# Altium schematic sheet BuckConverter.SchDoc
size A4; SheetNumber: 2; SheetTotal: 2
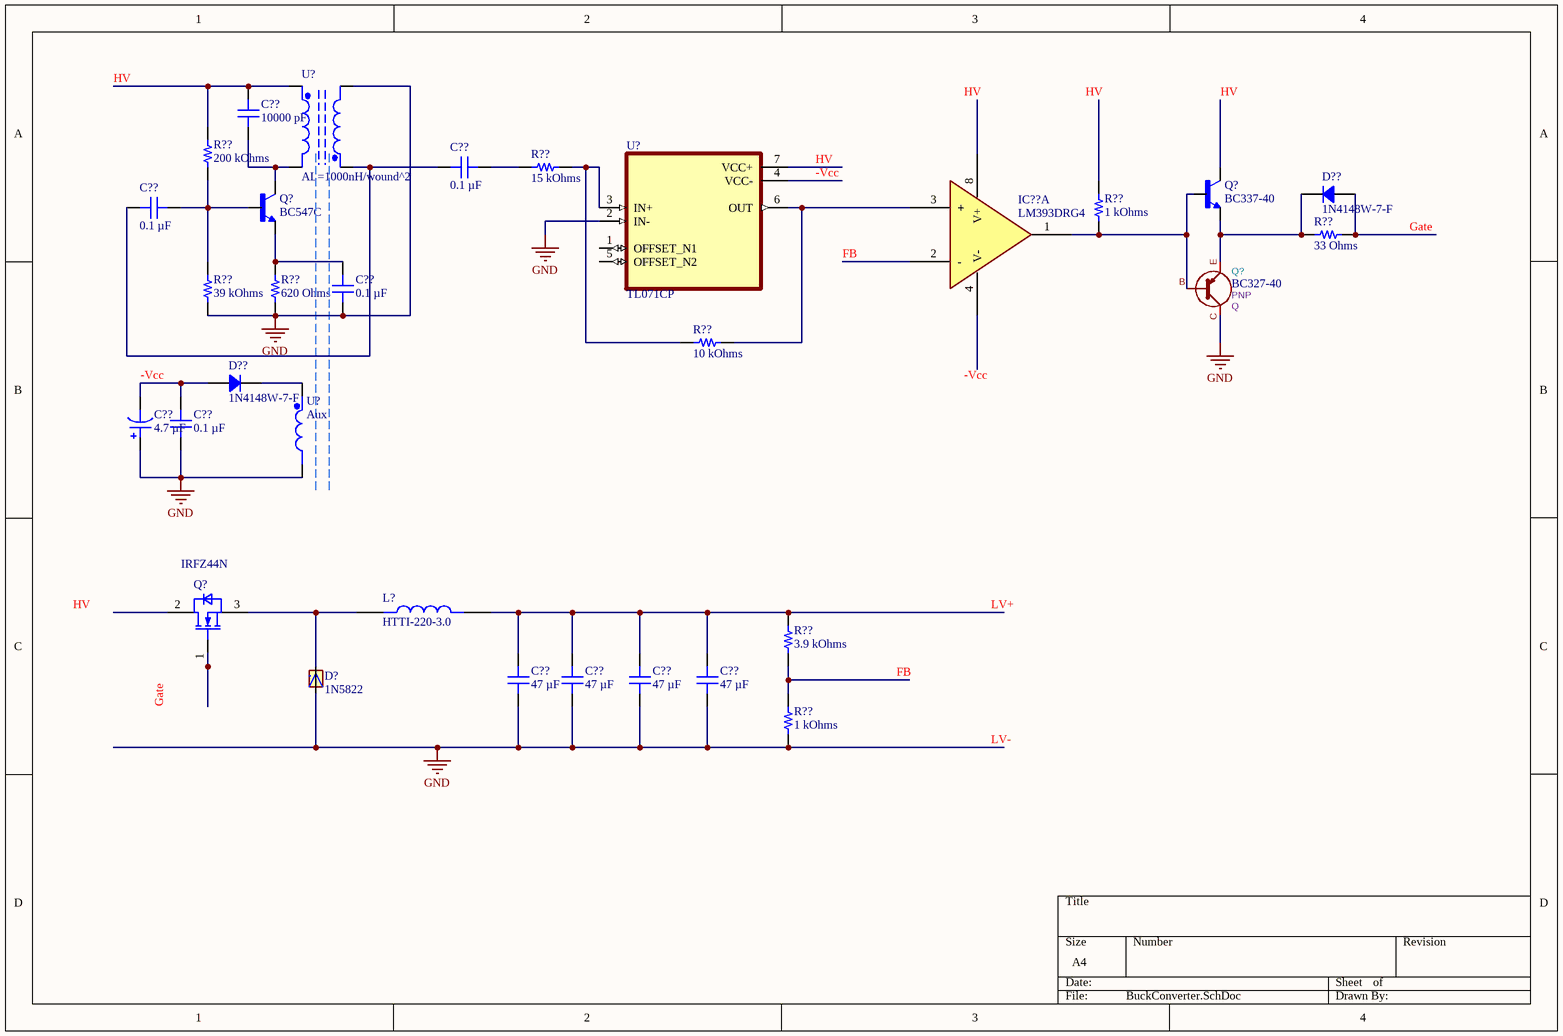
[diagram p0: BuckConverter.SchDoc]

## Parts
(Parts that share a designator on the sheet are numbered #1, #2 ... from top to bottom, then left to right.)
C??#1  10000 pF  [CAP 1812_4532 1.1MM]
C??#2  0.1 µF  [CAP 0805_2012]
C??#3  0.1 µF  [CAP 0805_2012]
C??#4  0.1 µF  [CAP 0805_2012]
C??#5  4.7 µF  [CAP ALSMD 4.3MM H5.4MM]
C??#6  0.1 µF  [CAP 0805_2012]
C??#7  47 µF  [CAP 1210_3225 - 1MM]
C??#8  47 µF  [CAP 1210_3225 - 1MM]
C??#9  47 µF  [CAP 1210_3225 - 1MM]
C??#10  47 µF  [CAP 1210_3225 - 1MM]
D?  1N5822  [DIOAD2120W130L950D530P]
D??#1  1N4148W-7-F  [SOD-123]
D??#2  1N4148W-7-F  [SOD-123]
IC??  LM393DRG4  [TI SOIC-8 D]  (part A of 2)
L?  HTTI-220-3.0  [IND_HTTI-220-3.0]
Q?#1  BC337-40  [TO92127P460H470-3]
Q?#2  BC547C  [TRANS_BC547C]
Q?#3  BC327-40  value PNP  Reference: Q  [TO-92_CBE]
Q?#4  IRFZ44N
R??#1  200 kOhms  [RES 0805_2012]
R??#2  15 kOhms  [RES 0603_1608]
R??#3  1 kOhms  [RES 1206_3216]
R??#4  33 Ohms  [RES 1206_3216]
R??#5  39 kOhms  [YAGEO RES 0805_2012]
R??#6  620 Ohms  [RES 0805_2012]
R??#7  10 kOhms  [RES 0603_1608]
R??#8  3.9 kOhms  [RES 0603_1608]
R??#9  1 kOhms  [RES 0603_1608]
U?#1  AL=1000nH/wound^2  [EE16 N27 Ungapped]
U?#2  TL071CP  [DIP794W45P254L959H508Q8]
U?#3  Aux  [1206 Bead]

## Nets
GND: C??#4.1 C??#5.1 C??#6.1 C??#7.1 C??#8.1 C??#9.1 C??#10.1 D?.A Q?#3.C R??#5.1 R??#6.1 R??#9.1 U?#1.2 U?#2.2(IN-) U?#3.2
NetC??#1_1: C??#1.1 Q?#2.1(C) U?#1.4
NetC??#1_2: C??#1.2 R??#1.2 U?#1.1
NetC??#2_1: C??#2.1 C??#3.2 U?#1.3
NetC??#2_2: C??#2.2 R??#2.1
NetC??#3_1: C??#3.1 Q?#2.2(B) R??#1.1 R??#5.2
NetC??#4_2: C??#4.2 Q?#2.3(E) R??#6.2
NetC??#5_2: C??#5.2 C??#6.2 D??#2.1
NetC??#7_2: C??#7.2 C??#8.2 C??#9.2 C??#10.2 L?.2 R??#8.2
NetD??#1_1: D??#1.1 R??#4.2
NetD??#1_2: D??#1.2 Q?#1.3(E) Q?#3.E R??#4.1
NetD??#2_2: D??#2.2 U?#3.1
NetD?_C: D?.C L?.1 Q?#4.3(SOURCE)
NetIC??_1: IC??.1(OUTA) Q?#1.2(B) Q?#3.B R??#3.1
NetIC??_3: IC??.3(+) R??#7.2 U?#2.6(OUT)
NetR??#2_2: R??#2.2 R??#7.1 U?#2.3(IN+)
NetR??#8_1: R??#8.1 R??#9.2

Not connected (* = marked no-connect by the designer): IC?? 2(-) 4(V-) 8(V+); Q?#1 1(C); Q?#4 1(GATE) 2(DRAIN); R??#3 2; U?#2 1(OFFSET_N1) 4(VCC-) 5(OFFSET_N2) 7(VCC+)

## Notes on the sheet
- HV
- -Vcc
- Gate
- FB
- (near C??#5) -Vcc
- LV+
- (near Q?#4) Gate
- LV-

## Library data of the parts
C??#1 = 1812J1K00103JKT: 1812 1000VDC 10NF 5% C0G/NP0(1B); manufacturer: Knowles Syfer; Temperature Coefficient: C0G, NP0 (1B); Voltage - Rated: 1000V (1kV); Part Number: 1812J1K00103JKT; Value: 10000 pF; Applications: Automotive; Capacitance: 10000 pF; componentlink2description: DigiKey Link; componentlink2url: https://www.digikey.com/en/products/detail/knowles-syfer/1812J1K00103JKT/18879719; Device Package: 1812 (4532 Metric); Features: High Voltage; lastupdated: 6.04.2026 19:46:49; Lifecycle Status: Active; Minimum Order: 1; Mounting Type: Surface Mount, MLCC; Operating Temperature: -55°C ~ 125°C; Package / Case: 1812 (4532 Metric); packaging: TapeAndReel; Part Status: Active; price: 0.87; Ratings: AEC-Q200; series: -; Size / Dimension: 0.177" L x 0.126" W (4.50mm x 3.20mm); Supplier 1: DigiKey; Supplier Part Number 1: 1608-1812J1K00103JKTCT-ND; Thickness (Max): 0.126" (3.20mm); Tolerance: ±5%
C??#2-C??#4 C??#6 = GMC21X5R104K10NT: CAP0805 X5R .1UF 10% 35V; manufacturer: Cal-Chip Electronics, Inc.; Voltage - Rated: 10V; Part Number: GMC21X5R104K10NT; Applications: General Purpose; componentlink1description: Datasheet; componentlink1url: https://calchip.com/wp-content/uploads/2024/02/gmc_series-1.pdf; componentlink2description: DigiKey Link; componentlink2url: https://www.digikey.com/en/products/detail/cal-chip-electronics-inc/GMC21X5R104K10NT/25622748; Device Package: 0805 (2012 Metric); lastupdated: 6.04.2026 19:28:50; Lifecycle Status: Active; Minimum Order: 1; Mounting Type: Surface Mount, MLCC; Operating Temperature: -55°C ~ 85°C; Package / Case: 0805 (2012 Metric); packaging: TapeAndReel; partid: 70307; price: 0.01; series: GMC; Size / Dimension: 0.079" L x 0.049" W (2.00mm x 1.25mm); Supplier 1: DigiKey; Supplier Part Number 1: 4713-GMC21X5R104K10NTCT-ND; Temperature Coefficient: X5R; Thickness (Max): 0.037" (0.95mm); Tolerance: ±10%; value: 0.1 µF; Capacitance: 0.1 µF
C??#5 = EEE-1CA4R7NR: CAP ALUM 4.7UF 20% 16V SMD; manufacturer: Panasonic Electronic Components; Lifetime @ Temp.: 2000 Hrs @ 85°C; Polarization: Polar; Ripple Current @ High Frequency: 34 mA @ 10 kHz; Ripple Current @ Low Frequency: 20 mA @ 120 Hz; Surface Mount Land Size: 0.169" L x 0.169" W (4.30mm x 4.30mm); Part Number: EEE-1CA4R7NR; Applications: Automotive; Capacitance: 4.7 µF; componentlink1description: Datasheet; componentlink1url: //media.digikey.com/pdf/Data%20Sheets/Panasonic%20Electronic%20Components/S_Series,Type_V_Rev2018.pdf; componentlink2description: DigiKey Link; componentlink2url: https://www.digikey.com/en/products/detail/panasonic-electronic-components/EEE-1CA4R7NR/946205; Device Package: Radial, Can - SMD; Height - Seated (Max): 0.217" (5.50mm); lastupdated: 5.04.2026 20:29:49; Lifecycle Status: Active; Minimum Order: 1; Mounting Type: Surface Mount; Operating Temperature: -40°C ~ 85°C; Package / Case: Radial, Can - SMD; packaging: TapeAndReel; partid: 7087; Part Status: Active; price: 0.07; Ratings: AEC-Q200; series: S; Size / Dimension: 0.157" Dia (4.00mm); Supplier 1: DigiKey; Supplier Part Number 1: PCE4290CT-ND; Tolerance: ±20%; value: 4.7 µF; Voltage - Rated: 16 V
C??#7-C??#10 = C1210C476M4PAC7800: CAP CER 47UF 16V X5R 1210; manufacturer: KEMET; Tolerance: ±20%; Part Number: C1210C476M4PAC7800; Applications: Bypass, Decoupling; Capacitance: 47 µF; componentlink1description: Datasheet; componentlink1url: https://connect.kemet.com:7667/gateway/IntelliData-ComponentDocumentation/1.0/download/datasheet/C1210C476M4PACTU; componentlink2description: DigiKey Link; componentlink2url: https://www.digikey.com/en/products/detail/kemet/C1210C476M4PAC7800/1950674; Device Package: 1210 (3225 Metric); lastupdated: 6.04.2026 19:45:26; Lifecycle Status: Active; Minimum Order: 1; Mounting Type: Surface Mount, MLCC; Operating Temperature: -55°C ~ 85°C; Package / Case: 1210 (3225 Metric); packaging: TapeAndReel; partid: 45193; Part Status: Active; price: 0.32; series: SMD Comm X5R; Size / Dimension: 0.126" L x 0.098" W (3.20mm x 2.50mm); Supplier 1: DigiKey; Supplier Part Number 1: 399-C1210C476M4PAC7800CT-ND; Temperature Coefficient: X5R; Thickness (Max): 0.110" (2.80mm); Voltage - Rated: 16V; Value: 47 µF
D? = 1N5822: Schottky, DO-201, 40V, 3A, 150Â°C; MF: Diotec Semiconductor; SnapEDA_Link: https://www.snapeda.com/parts/1N5822/Diotec/view-part/?ref=snap; Package: DO-201 Diotec; Value: *; MP: 1N5822; Check_prices: https://www.snapeda.com/parts/1N5822/Diotec/view-part/?ref=eda
D??#1 D??#2 = 1N4148W-7-F: DIODE STANDARD 100V 150MA SOD123; Manufacturer: Diodes Incorporated; Capacitance @ Vr, F: 2pF @ 0V, 1MHz; Current - Reverse Leakage @ Vr: 1 µA @ 75 V; Reverse Recovery Time (trr): 4 ns; Speed: Fast Recovery =< 500ns, > 200mA (Io); Voltage - Forward (Vf) (Max) @ If: 1.25 V @ 150 mA; Part Number: 1N4148W-7-F; ComponentLink1Description: Datasheet; ComponentLink1URL: https://www.diodes.com/assets/Datasheets/ds30086.pdf; ComponentLink2Description: DigiKey Link; ComponentLink2URL: https://www.digikey.com/en/products/detail/diodes-incorporated/1N4148W-7-F/814371; Current - Average Rectified (Io): 150mA; Diode Type: Standard; LastUpdated: 5.04.2026 20:31:46; Lifecycle Status: Active; Minimum Order: 1; Mounting Type: Surface Mount; Operating Temperature - Junction: -55°C ~ 150°C; Package / Case: SOD-123; Packaging: TapeAndReel; PartId: 1002; Part Status: Active; Price: 0.02; Series: -; Supplier 1: DigiKey; Supplier Part Number 1: 1N4148W-FDICT-ND; Supplier Device Package: SOD-123; Voltage - DC Reverse (Vr) (Max): 100 V
IC?? = LM393DRG4: IC DUAL DIFF COMPARATOR 8-SOIC; Manufacturer: Texas Instruments; Current - Input Bias (Max): 0.25µA @ 5V; Current - Output (Typ): 20mA; Current - Quiescent (Max): 2.5mA; Number of Elements: 2; Output Type: CMOS, MOS, Open-Drain, TTL; Voltage - Input Offset (Max): 5mV @ 30V; Voltage - Supply, Single/Dual (±): 2V ~ 36V, ±1V ~ 18V; Part Number: LM393DRG4; ComponentLink1Description: Datasheet; ComponentLink1URL: http://www.ti.com/general/docs/suppproductinfo.tsp?distId=10&gotoUrl=http%3A%2F%2Fwww.ti.com%2Flit%2Fgpn%2Flm193; ComponentLink2Description: DigiKey Link; ComponentLink2URL: http://digikey.com/product-detail/en/texas-instruments/LM393DRG4/296-31672-1-ND/3505876; Device Package: 8-SOIC (0.154", 3.90mm Width); LastUpdated: 30.03.2020 15:17:12; Lifecycle Status: Active; Minimum Order: 1; Mounting Type: Surface Mount; Operating Temperature: 0°C ~ 70°C; Package / Case: 8-SOIC (0.154", 3.90mm Width); Packaging: TapeAndReel; Part Status: Active; Price: 0.10; Series: -; Supplier 1: DigiKey; Supplier Part Number 1: 296-31672-1-ND; Supplier Device Package: 8-SOIC; Type: Differential
L? = HTTI-220-3.0: High Current High Temperature Toroidal Inductor | 220uH | 3A | 0.13Ohm; MF: Signal Transformer; SnapEDA_Link: https://www.snapeda.com/parts/HTTI-220-3.0/Signal+Transformer/view-part/?ref=snap; Package: None; Value: *; MP: HTTI-220-3.0; Check_prices: https://www.snapeda.com/parts/HTTI-220-3.0/Signal+Transformer/view-part/?ref=eda
Q?#1 = BC337-40: BJT, TO-92, 45V, 800mA, NPN, 0.625W, 150Â°C; MF: Diotec Semiconductor; SnapEDA_Link: https://www.snapeda.com/parts/BC337-40/Diotec/view-part/?ref=snap; Package: TO-92 Diotec; Value: *; MP: BC337-40; Check_prices: https://www.snapeda.com/parts/BC337-40/Diotec/view-part/?ref=eda
Q?#2 = BC547C: BJT, TO-92, 45V, 100mA, NPN, 0.5W, 150Â°C; MF: Diotec Semiconductor; SnapEDA_Link: https://www.snapeda.com/parts/BC547C/Diotec/view-part/?ref=snap; Package: TO-92 Diotec; Value: *; MP: BC547C; Check_prices: https://www.snapeda.com/parts/BC547C/Diotec/view-part/?ref=eda
Q?#3 = PNP: ki_keywords: PNP Bipolar Transistor; ki_description: Symbol for PNP BJT
Q?#4 = IRFZ44N: OptiMOS 3 Power-Transistor, VDS 100V; Manufacturer: Infineon Technologies; Manufacturer Order Number: IRFZ44N; PackageReference: PG-TO220-3-904
R??#1 = RNCF0805DTE200K: RES SMD 200K OHM 0.5% 1/4W 0805; Manufacturer: Stackpole Electronics Inc; Power (Watts): 0.25W, 1/4W; Temperature Coefficient: ±25ppm/°C; Part Number: RNCF0805DTE200K; Value: 200 kOhms; ComponentLink1Description: Datasheet; ComponentLink1URL: https://www.seielect.com/catalog/sei-rncf.pdf; ComponentLink2Description: DigiKey Link; ComponentLink2URL: https://www.digikey.com/en/products/detail/stackpole-electronics-inc/RNCF0805DTE200K/6242022; Composition: Thin Film; Device Package: 0805 (2012 Metric); Features: Automotive AEC-Q200; Height - Seated (Max): 0.026" (0.65mm); LastUpdated: 5.04.2026 20:11:25; Lifecycle Status: Active; Minimum Order: 1; Number of Terminations: 2; Operating Temperature: -55°C ~ 155°C; Package / Case: 0805 (2012 Metric); Packaging: TapeAndReel; PartId: 27998; Part Status: Active; Price: 0.01; Ratings: AEC-Q200; Resistance: 200 kOhms; Series: RNCF; Size / Dimension: 0.079" L x 0.049" W (2.00mm x 1.25mm); Supplier 1: DigiKey; Supplier Part Number 1: 738-RNCF0805DTE200KCT-ND; Supplier Device Package: 0805; Tolerance: ±0.5%
R??#2 = RMCF0603JG15K0: RES 15K OHM 5% 1/10W 0603; Manufacturer: Stackpole Electronics Inc; Power (Watts): 0.1W, 1/10W; Temperature Coefficient: ±200ppm/°C; Part Number: RMCF0603JG15K0; Value: 15 kOhms; ComponentLink1Description: Datasheet; ComponentLink1URL: https://www.seielect.com/catalog/sei-rmcf_rmcp.pdf; ComponentLink2Description: DigiKey Link; ComponentLink2URL: https://www.digikey.com/en/products/detail/stackpole-electronics-inc/RMCF0603JG15K0/1712157; Composition: Thick Film; Device Package: 0603 (1608 Metric); Features: Automotive AEC-Q200; Height - Seated (Max): 0.022" (0.55mm); LastUpdated: 9.02.2024 20:43:35; Lifecycle Status: Active; Minimum Order: 1; Number of Terminations: 2; Operating Temperature: -55°C ~ 155°C; Package / Case: 0603 (1608 Metric); Packaging: CutTape; PartId: 5200; Part Status: Active; Price: 0.01; Ratings: AEC-Q200; Resistance: 15 kOhms; Series: RMCF; Size / Dimension: 0.061" L x 0.031" W (1.55mm x 0.80mm); Supplier 1: DigiKey; Supplier Part Number 1: RMCF0603JG15K0CT-ND; Supplier Device Package: 0603; Tolerance: ±5%
R??#3 = 3430B2F1K0TDF: 3430 B2 1% 1K0 100PPM 1K RL; Manufacturer: TE Connectivity Passive Product; Power (Watts): 1.5W; Temperature Coefficient: ±100ppm/°C; Part Number: 3430B2F1K0TDF; ComponentLink2Description: DigiKey Link; ComponentLink2URL: https://www.digikey.com/en/products/detail/te-connectivity-passive-product/3430B2F1K0TDF/17764078; Composition: Thick Film; Device Package: 1206 (3216 Metric); Features: Automotive AEC-Q200; Height - Seated (Max): 0.026" (0.65mm); LastUpdated: 6.04.2026 19:58:24; Lifecycle Status: Active; Minimum Order: 1; Number of Terminations: 2; Operating Temperature: -55°C ~ 155°C; Package / Case: 1206 (3216 Metric); Packaging: TapeAndReel; PartId: 77709; Part Status: Active; Price: 0.07; Ratings: AEC-Q200; Resistance: 1 kOhms; Series: 3430; Size / Dimension: 0.061" L x 0.118" W (1.55mm x 3.00mm); Supplier 1: DigiKey; Supplier Part Number 1: 1712-3430B2F1K0TDFCT-ND; Supplier Device Package: 0612; Tolerance: ±1%; Value: 1 kOhms
R??#4 = AC1206JR-0733RL: RES SMD 33 OHM 5% 1/4W 1206; Manufacturer: Yageo; Power (Watts): 0.25W, 1/4W; Temperature Coefficient: ±100ppm/°C; Part Number: AC1206JR-0733RL; ComponentLink1Description: Datasheet; ComponentLink1URL: https://www.yageo.com/upload/media/product/productsearch/datasheet/rchip/PYu-AC_51_RoHS_L_7.pdf; ComponentLink2Description: DigiKey Link; ComponentLink2URL: https://www.digikey.com/en/products/detail/yageo/AC1206JR-0733RL/5897837; Composition: Thick Film; Device Package: 1206 (3216 Metric); Features: Automotive AEC-Q200, Moisture Resistant; Height - Seated (Max): 0.026" (0.65mm); LastUpdated: 6.04.2026 20:00:51; Lifecycle Status: Active; Minimum Order: 1; Number of Terminations: 2; Operating Temperature: -55°C ~ 155°C; Package / Case: 1206 (3216 Metric); Packaging: TapeAndReel; PartId: 27117; Part Status: Active; Price: 0.01; Ratings: AEC-Q200; Resistance: 33 Ohms; Series: AC; Size / Dimension: 0.122" L x 0.063" W (3.10mm x 1.60mm); Supplier 1: DigiKey; Supplier Part Number 1: YAG3955CT-ND; Supplier Device Package: 1206; Tolerance: ±5%; Value: 33 Ohms
R??#5 = AC0805FR-0739KL: RES SMD 39K OHM 1% 1/8W 0805; Manufacturer: Yageo; Power (Watts): 0.125W, 1/8W; Temperature Coefficient: ±100ppm/°C; Part Number: AC0805FR-0739KL; Value: 39 kOhms; ComponentLink1Description: Datasheet; ComponentLink1URL: https://www.yageo.com/upload/media/product/productsearch/datasheet/rchip/PYu-AC_51_RoHS_L_7.pdf; ComponentLink2Description: DigiKey Link; ComponentLink2URL: https://www.digikey.com/en/products/detail/yageo/AC0805FR-0739KL/5896800; Composition: Thick Film; Device Package: 0805 (2012 Metric); Features: Automotive AEC-Q200, Moisture Resistant; Height - Seated (Max): 0.024" (0.60mm); LastUpdated: 5.04.2026 21:18:18; Lifecycle Status: Active; Minimum Order: 1; Number of Terminations: 2; Operating Temperature: -55°C ~ 155°C; Package / Case: 0805 (2012 Metric); Packaging: CutTape; PartId: 27853; Part Status: Active; Price: 0.01; Ratings: AEC-Q200; Resistance: 39 kOhms; Series: AC; Size / Dimension: 0.079" L x 0.049" W (2.00mm x 1.25mm); Supplier 1: DigiKey; Supplier Part Number 1: YAG3727CT-ND; Supplier Device Package: 0805; Tolerance: ±1%
R??#6 = CRCW0805620RFKEA: RES SMD 620 OHM 1% 1/8W 0805; Manufacturer: Vishay Dale; Power (Watts): 0.125W, 1/8W; Temperature Coefficient: ±100ppm/°C; Part Number: CRCW0805620RFKEA; Value: 620 Ohms; ComponentLink1Description: Datasheet; ComponentLink1URL: http://www.vishay.com/docs/20035/dcrcwe3.pdf; ComponentLink2Description: DigiKey Link; ComponentLink2URL: https://www.digikey.com/en/products/detail/vishay-dale/CRCW0805620RFKEA/1175614; Composition: Thick Film; Device Package: 0805 (2012 Metric); Features: Automotive AEC-Q200; Height - Seated (Max): 0.020" (0.50mm); LastUpdated: 5.04.2026 20:11:04; Lifecycle Status: Active; Minimum Order: 1; Number of Terminations: 2; Operating Temperature: -55°C ~ 155°C; Package / Case: 0805 (2012 Metric); Packaging: TapeAndReel; PartId: 32921; Part Status: Active; Price: 0.01; Ratings: AEC-Q200; Resistance: 620 Ohms; Series: D/CRCW e3; Size / Dimension: 0.079" L x 0.049" W (2.00mm x 1.25mm); Supplier 1: DigiKey; Supplier Part Number 1: 541-620CCT-ND; Supplier Device Package: 0805; Tolerance: ±1%
R??#7 = RNCS0603BKE10K0: RES 10K OHM 0.1% 1/16W 0603; Manufacturer: Stackpole Electronics Inc; Power (Watts): 0.063W, 1/16W; Temperature Coefficient: ±25ppm/°C; Part Number: RNCS0603BKE10K0; Value: 10 kOhms; ComponentLink1Description: Datasheet; ComponentLink1URL: https://www.seielect.com/catalog/sei-rncs_rnch.pdf; ComponentLink2Description: DigiKey Link; ComponentLink2URL: https://www.digikey.com/en/products/detail/stackpole-electronics-inc/RNCS0603BKE10K0/1708836; Composition: Thin Film; Device Package: 0603 (1608 Metric); Features: Anti-Corrosive, Automotive AEC-Q200, Moisture Resistant; Height - Seated (Max): 0.022" (0.55mm); LastUpdated: 9.02.2024 20:43:37; Lifecycle Status: Active; Minimum Order: 1; Number of Terminations: 2; Operating Temperature: -55°C ~ 155°C; Package / Case: 0603 (1608 Metric); Packaging: TapeAndReel; PartId: 4838; Part Status: Active; Price: 0.06; Ratings: AEC-Q200; Resistance: 10 kOhms; Series: RNCS; Size / Dimension: 0.061" L x 0.031" W (1.55mm x 0.80mm); Supplier 1: DigiKey; Supplier Part Number 1: RNCS0603BKE10K0CT-ND; Supplier Device Package: 0603; Tolerance: ±0.1%
R??#8 = CMP0603-FX-3901ELF: RESHIGHPOWER 0603 3K9 1% 1/4W TC; Manufacturer: Bourns Inc.; Power (Watts): 0.25W, 1/4W; Temperature Coefficient: ±100ppm/°C; Part Number: CMP0603-FX-3901ELF; Value: 3.9 kOhms; ComponentLink1Description: Datasheet; ComponentLink1URL: https://www.bourns.com/docs/Product-Datasheets/CMP.pdf; ComponentLink2Description: DigiKey Link; ComponentLink2URL: https://www.digikey.com/en/products/detail/bourns-inc/CMP0603-FX-3901ELF/12333604; Composition: Thick Film; Device Package: 0603 (1608 Metric); Features: Pulse Withstanding; Height - Seated (Max): 0.022" (0.55mm); LastUpdated: 9.02.2024 20:41:39; Lifecycle Status: Active; Minimum Order: 1; Number of Terminations: 2; Operating Temperature: -55°C ~ 155°C; Package / Case: 0603 (1608 Metric); Packaging: TapeAndReel; PartId: 64085; Part Status: Active; Price: 0.02; Resistance: 3.9 kOhms; Series: CMP; Size / Dimension: 0.063" L x 0.031" W (1.60mm x 0.80mm); Supplier 1: DigiKey; Supplier Part Number 1: 118-CMP0603-FX-3901ELFCT-ND; Supplier Device Package: 0603; Tolerance: ±1%
R??#9 = AT0603DRD071KL: RES SMD 1K OHM 0.5% 1/10W 0603; Manufacturer: Yageo; Power (Watts): 0.1W, 1/10W; Temperature Coefficient: ±25ppm/°C; Part Number: AT0603DRD071KL; ComponentLink1Description: Datasheet; ComponentLink1URL: http://www.yageo.com/documents/recent/PYu-AT_51_RoHS_L_5.pdf; ComponentLink2Description: DigiKey Link; ComponentLink2URL: https://www.digikey.com/en/products/detail/yageo/AT0603DRD071KL/5138634; Composition: Thin Film; Device Package: 0603 (1608 Metric); Features: Anti-Sulfur, Automotive AEC-Q200, Moisture Resistant; Height - Seated (Max): 0.022" (0.55mm); LastUpdated: 6.04.2026 19:44:01; Lifecycle Status: Active; Minimum Order: 1; Number of Terminations: 2; Operating Temperature: -55°C ~ 155°C; Package / Case: 0603 (1608 Metric); Packaging: TapeAndReel; PartId: 4899; Part Status: Active; Price: 0.02; Ratings: AEC-Q200; Resistance: 1 kOhms; Series: AT; Size / Dimension: 0.063" L x 0.031" W (1.60mm x 0.80mm); Supplier 1: DigiKey; Supplier Part Number 1: YAG2115CT-ND; Supplier Device Package: 0603; Tolerance: ±0.5%; Value: 1 kOhms
U?#1 = EE16 N27 Ungapped: EE16 N27 Ungapped AL=1000nH/wound^2                                                                                    Np=32, Ns=35, Naux=30                                                                                                                L=1mH
U?#2 = TL071CP: Single, 30-V, 3-MHz, high slew rate (13-V/Âµs), In to V+, JFET-input op amp; MF: Texas Instruments; SnapEDA_Link: https://www.snapeda.com/parts/TL071CP/Texas+Instruments/view-part/?ref=snap; Package: PDIP-8 Texas; Value: *; MP: TL071CP; Check_prices: https://www.snapeda.com/parts/TL071CP/Texas+Instruments/view-part/?ref=eda